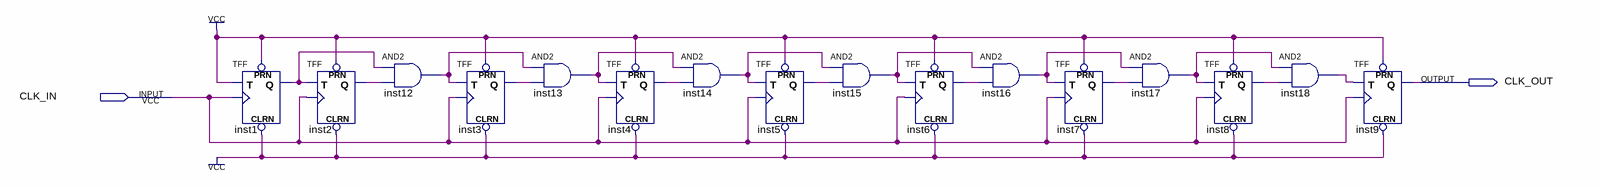
[diagram p0: schematic sheet]
// Quartus schematic Clock_divider_512.bdf as structural Verilog: 16 symbols, 2 pins
module Clock_divider_512 (
  input  CLK_IN,
  output CLK_OUT
);

  wire inst1_q, inst2_q, inst3_q, inst4_q, inst5_q, inst6_q, inst7_q, inst8_q, inst12_out, inst13_out,
       inst14_out, inst15_out, inst16_out, inst17_out, inst18_out;

  TFF inst1 (.PRN(1'b1), .CLRN(1'b1), .T(1'b1), .CLK(CLK_IN), .Q(inst1_q));
  TFF inst2 (.PRN(1'b1), .CLRN(1'b1), .T(inst1_q), .CLK(CLK_IN), .Q(inst2_q));
  and inst12 (inst12_out, inst1_q, inst2_q);
  TFF inst3 (.PRN(1'b1), .CLRN(1'b1), .T(inst12_out), .CLK(CLK_IN), .Q(inst3_q));
  and inst13 (inst13_out, inst12_out, inst3_q);
  TFF inst4 (.PRN(1'b1), .CLRN(1'b1), .T(inst13_out), .CLK(CLK_IN), .Q(inst4_q));
  and inst14 (inst14_out, inst13_out, inst4_q);
  TFF inst5 (.PRN(1'b1), .CLRN(1'b1), .T(inst14_out), .CLK(CLK_IN), .Q(inst5_q));
  and inst15 (inst15_out, inst14_out, inst5_q);
  TFF inst6 (.PRN(1'b1), .CLRN(1'b1), .T(inst15_out), .CLK(CLK_IN), .Q(inst6_q));
  and inst16 (inst16_out, inst15_out, inst6_q);
  TFF inst7 (.PRN(1'b1), .CLRN(1'b1), .T(inst16_out), .CLK(CLK_IN), .Q(inst7_q));
  and inst17 (inst17_out, inst16_out, inst7_q);
  TFF inst8 (.PRN(1'b1), .CLRN(1'b1), .T(inst17_out), .CLK(CLK_IN), .Q(inst8_q));
  and inst18 (inst18_out, inst17_out, inst8_q);
  TFF inst9 (.PRN(1'b1), .CLRN(1'b1), .T(inst18_out), .CLK(CLK_IN), .Q(CLK_OUT));
endmodule
